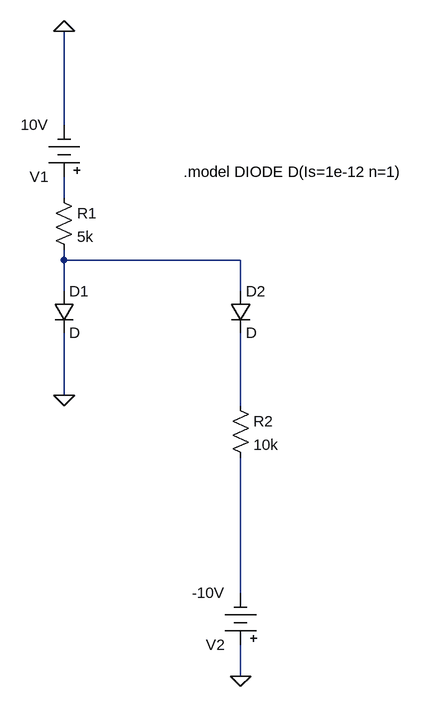
[diagram p0: schematic 3.1aone.asc]
3.1aone.asc, the LTspice schematic file:
Version 4
SHEET 1 880 680
WIRE -240 -352 -240 -496
WIRE -240 -240 -240 -272
WIRE -240 -144 -240 -160
WIRE 32 -144 -240 -144
WIRE -240 -96 -240 -144
WIRE 32 -96 32 -144
WIRE -240 64 -240 -32
WIRE 32 80 32 -32
WIRE 32 368 32 160
WIRE 32 496 32 448
FLAG -240 64 0
FLAG -240 -496 0
FLAG 32 496 0
SYMBOL res -256 -256 R0
SYMATTR InstName R1
SYMATTR Value 5k
SYMBOL Misc\\battery -240 -256 R180
WINDOW 123 0 0 Left 2
WINDOW 39 0 0 Left 2
SYMATTR InstName V1
SYMATTR Value 10V
SYMBOL Misc\\battery 32 464 R180
WINDOW 123 0 0 Left 2
WINDOW 39 0 0 Left 2
SYMATTR InstName V2
SYMATTR Value -10V
SYMBOL diode -256 -96 R0
SYMATTR InstName D1
SYMBOL diode 16 -96 R0
SYMATTR InstName D2
SYMBOL res 16 64 R0
SYMATTR InstName R2
SYMATTR Value 10k
TEXT -56 -280 Left 2 !.model DIODE D(Is=1e-12 n=1)

The netlist it stands for:
* 3.1aone.asc
R1 N001 N002 5k
V1 N001 0 10V
V2 0 N004 -10V
D1 N002 0 D
D2 N002 N003 D
R2 N003 N004 10k
.model D D
.lib standard.dio
.model DIODE D(Is=1e-12 n=1)
.backanno
.end